# EAGLE design APMiniMax_V2 (EAGLE 7.7.0)
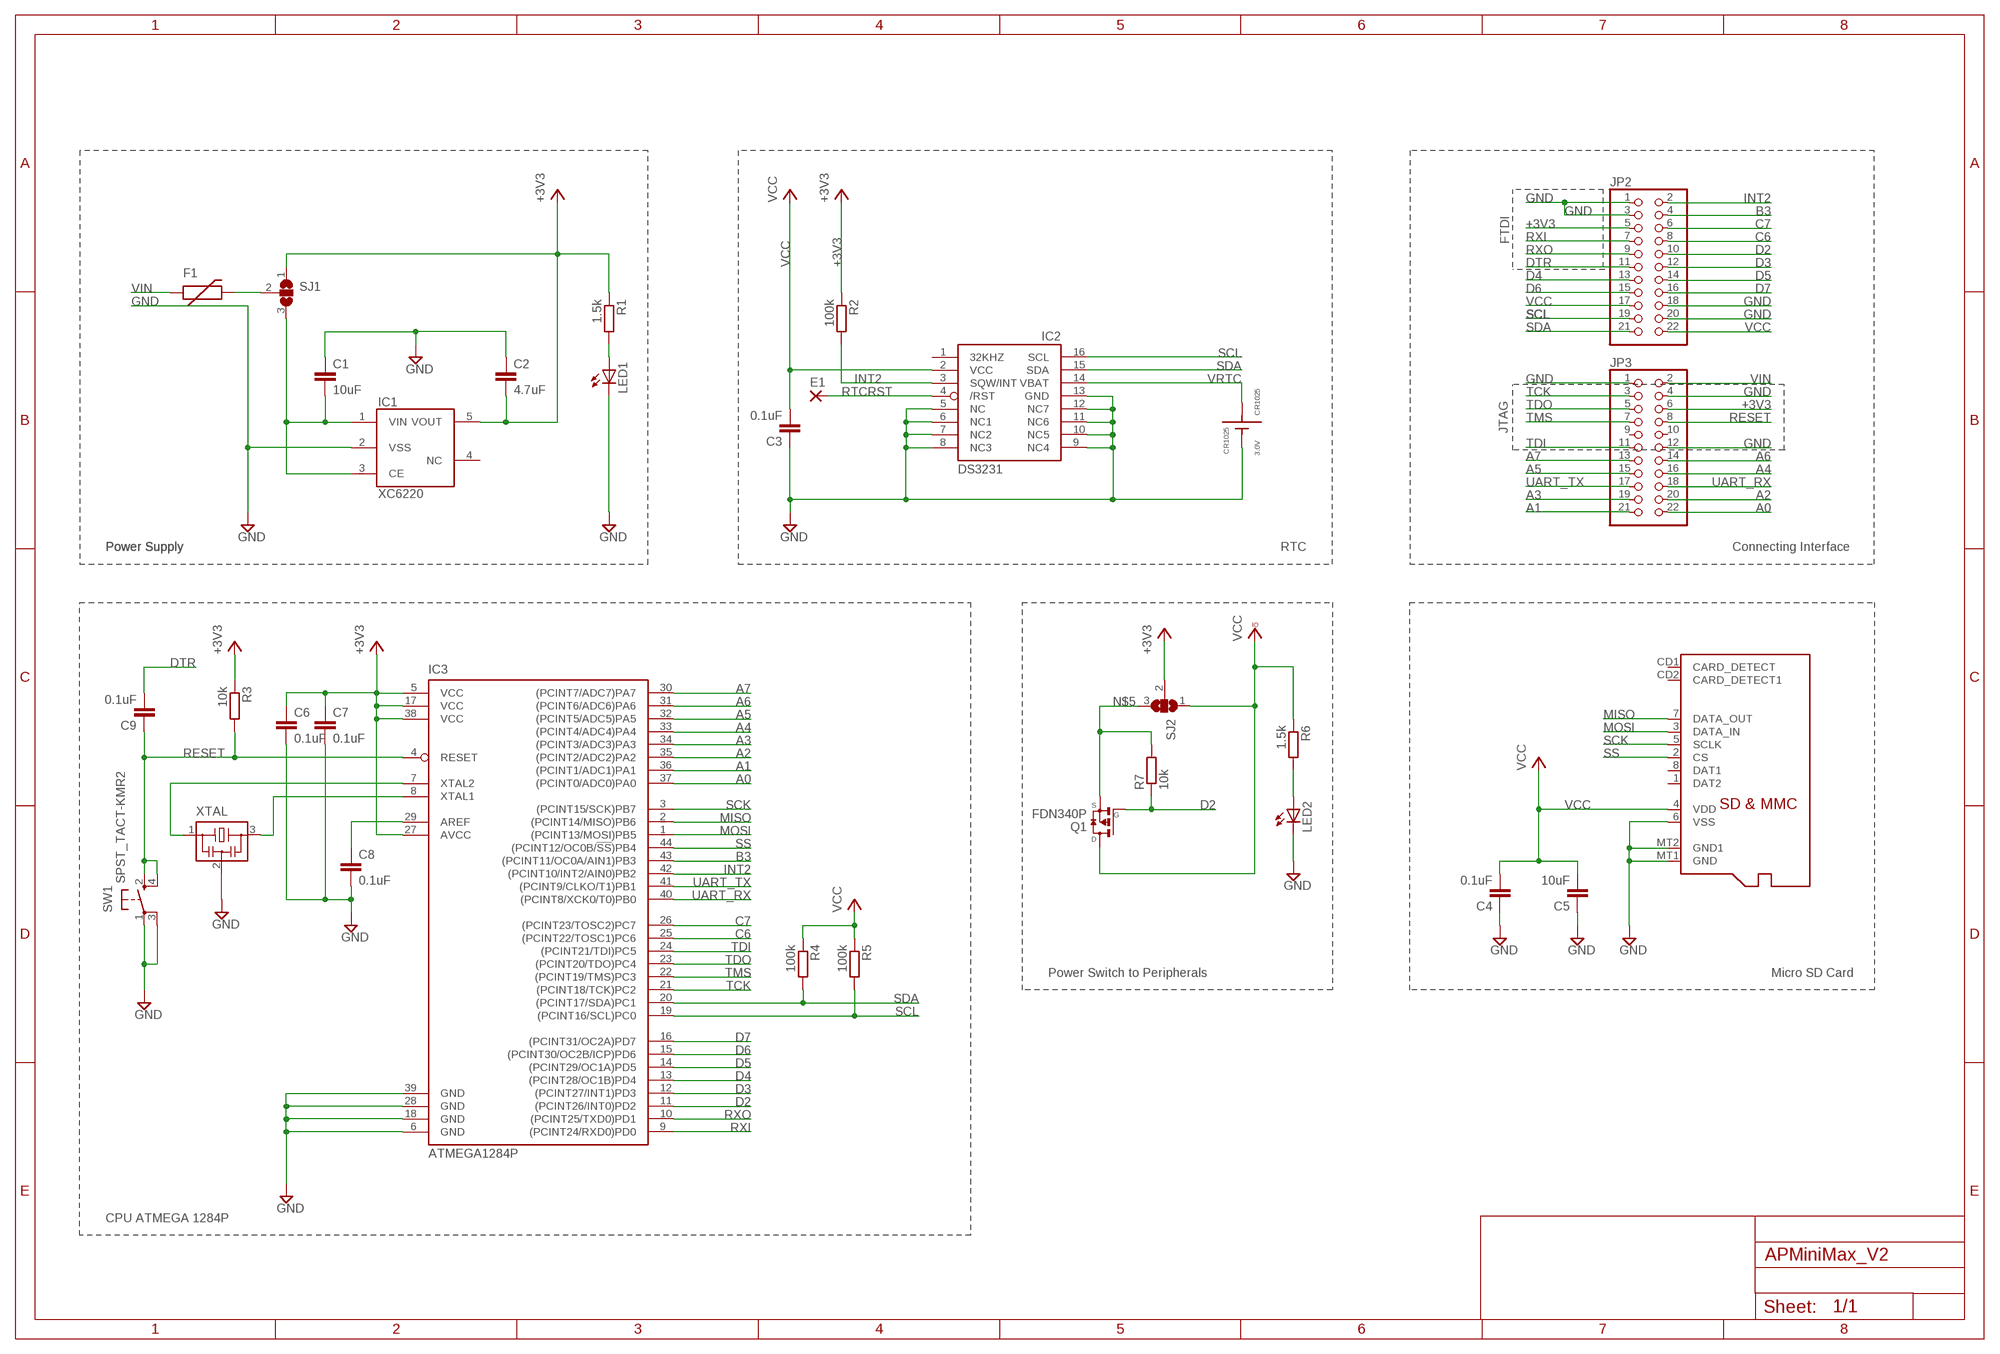
[diagram p0: schematic, sheet 1]

## Parts
C1  10uF  CC1206  [C1206]
C2  4.7uF  CC1206  [C1206]
C3  0.1uF  C  [C0805]
C4  0.1uF  C  [C0805]
C5  10uF  CC1206  [C1206]
C6  0.1uF  C  [C0805]
C7  0.1uF  C  [C0805]
C8  0.1uF  C  [C0805]
C9  0.1uF  C  [C0805]
CR1025  3.0V  CR1025  [CR1025SMD]
E1  0,75/0,5  [0,75/0,5]
F1  FUSE0805  [R0805]
IC1  XC6220SOT-25  [SOT25]
IC2  DS3231/SO  [SO16W]
IC3  ATMEGA1284P  ATMEGA644A  [TQFP44]
JP2  PINHD-2X11  [2X11]
JP3  PINHD-2X11  [2X11]
LED1  LEDCHIP-LED0805  [CHIP-LED0805]
LED2  LEDCHIP-LED0805  [CHIP-LED0805]
MMC  MICROSD  [MICROSD]
Q1  FDN340P  [SSOT-3]
R1  1.5k  R  [R0805]
R2  100k  R  [R0805]
R3  10k  R  [R0805]
R4  100k  R  [R0805]
R5  100k  R  [R0805]
R6  1.5k  R  [R0805]
R7  10k  R-EU_R0805  [R0805]
SJ1  SJ2W  [SJ_2]
SJ2  SJ2W  [SJ_2]
SW1  SPST_TACT-KMR2  [KMR2]
XTAL  CSTCE8M00G52-R0  [CSTCE]

## Nets
+3V3: C2.2 C6.1 C7.1 IC1.5(VOUT) IC3.5(VCC) IC3.17(VCC) IC3.27(AVCC) IC3.38(VCC) JP2.5 JP3.6 R1.1 R2.1 R3.1 SJ1.1 SJ2.2
A0: IC3.37((PCINT0/ADC0)PA0) JP3.22
A1: IC3.36((PCINT1/ADC1)PA1) JP3.21
A2: IC3.35((PCINT2/ADC2)PA2) JP3.20
A3: IC3.34((PCINT3/ADC3)PA3) JP3.19
A4: IC3.33((PCINT4/ADC4)PA4) JP3.16
A5: IC3.32((PCINT5/ADC5)PA5) JP3.15
A6: IC3.31((PCINT6/ADC6)PA6) JP3.14
A7: IC3.30((PCINT7/ADC7)PA7) JP3.13
AREF: C8.1 IC3.29(AREF)
B3: IC3.43((PCINT11/OC0A/AIN1)PB3) JP2.4
C6: IC3.25((PCINT22/TOSC1)PC6) JP2.8
C7: IC3.26((PCINT23/TOSC2)PC7) JP2.6
D2: IC3.11((PCINT26/INT0)PD2) JP2.10 Q1.1(G) R7.1
D3: IC3.12((PCINT27/INT1)PD3) JP2.12
D4: IC3.13((PCINT28/OC1B)PD4) JP2.13
D5: IC3.14((PCINT29/OC1A)PD5) JP2.14
D6: IC3.15((PCINT30/OC2B/ICP)PD6) JP2.15
D7: IC3.16((PCINT31/OC2A)PD7) JP2.16
DTR: C9.2 JP2.11
GND: C1.1 C2.1 C3.1 C4.1 C5.1 C6.2 C7.2 C8.2 CR1025.GND IC1.2(VSS) IC2.5(NC) IC2.6(NC1) IC2.7(NC2) IC2.8(NC3) IC2.9(NC4) IC2.10(NC5) IC2.11(NC6) IC2.12(NC7) IC2.13(GND) IC3.6(GND) IC3.18(GND) IC3.28(GND) IC3.39(GND) JP2.1 JP2.3 JP2.18 JP2.20 JP3.1 JP3.4 JP3.12 LED1.C LED2.C MMC.6(VSS) MMC.MT1(GND) MMC.MT2(GND1) SW1.1(P) SW1.3(P1) XTAL.2
INT2: IC2.3(SQW/INT) IC3.42((PCINT10/INT2/AIN0)PB2) JP2.2 R2.2
MISO: IC3.2((PCINT14/MISO)PB6) MMC.7(DATA_OUT)
MOSI: IC3.1((PCINT13/MOSI)PB5) MMC.3(DATA_IN)
N$1: LED1.A R1.2
N$2: F1.2 SJ1.2
N$3: C1.2 IC1.1(VIN) IC1.3(CE) SJ1.3
N$5: Q1.2(S) R7.2 SJ2.3
N$6: IC3.7(XTAL2) XTAL.1
N$7: IC3.8(XTAL1) XTAL.3
N$8: LED2.A R6.2
RESET: C9.1 IC3.4(RESET) JP3.8 R3.2 SW1.2(S) SW1.4(S1)
RTCRST: E1.1(P) IC2.4(/RST)
RXI: IC3.9((PCINT24/RXD0)PD0) JP2.7
RXO: IC3.10((PCINT25/TXD0)PD1) JP2.9
SCK: IC3.3((PCINT15/SCK)PB7) MMC.5(SCLK)
SCL: IC2.16(SCL) IC3.19((PCINT16/SCL)PC0) JP2.19 R5.2
SDA: IC2.15(SDA) IC3.20((PCINT17/SDA)PC1) JP2.21 R4.2
SS: IC3.44((PCINT12/OC0B/!SS!)PB4) MMC.2(CS)
TCK: IC3.21((PCINT18/TCK)PC2) JP3.3
TDI: IC3.24((PCINT21/TDI)PC5) JP3.11
TDO: IC3.23((PCINT20/TDO)PC4) JP3.5
TMS: IC3.22((PCINT19/TMS)PC3) JP3.7
UART_RX: IC3.40((PCINT8/XCK0/T0)PB0) JP3.18
UART_TX: IC3.41((PCINT9/CLKO/T1)PB1) JP3.17
VCC: C3.2 C4.2 C5.2 IC2.2(VCC) JP2.17 JP2.22 MMC.4(VDD) Q1.3(D) R4.1 R5.1 R6.1 SJ2.1
VIN: F1.1 JP3.2
VRTC: CR1025.V+@1(V+) CR1025.V+@2(V+) IC2.14(VBAT)
Unconnected: IC1.4(NC) IC2.1(32KHZ) JP3.9 JP3.10 MMC.1(DAT2) MMC.8(DAT1) MMC.CD1(CARD_DETECT) MMC.CD2(CARD_DETECT1)

## Notes on the sheet
- FTDI
- JTAG
- Power Supply | Power Supply | RTC | Connecting Interface
- Power Switch to Peripherals | Micro SD Card
- CPU ATMEGA 1284P

## Library data of the parts
C1-C9 = eagle-ltspice:C: CAPACITOR, European symbol; SPICEMODEL: NONE; SPICEPREFIX: C
CR1025 = eawag:CR1025
E1 = wirepad:0,75/0,5: THROUGH-HOLE PAD
F1 = Unilogger:FUSE0805
IC1 = eawag:XC6220: XC6220 Series 1A LDO Voltage Regulator with "Green Operation" Digikey Part Nr: 893-1133-1-ND
IC2 = adafruit:DS3231
IC3 = atmel:ATMEGA644: 8-bit Microcontroller with 64K Bytes In-System Programmable Flash Source: http://www.atmel.com/dyn/resources/prod_documents/doc2593.pdf; MPN: ATMEGA644PV-10AU; OC_FARNELL: 1455123; OC_NEWARK: 58M3748
JP2 JP3 = pinhead:PINHD-2X11: PIN HEADER
LED1 LED2 = eawag:LED: LED OSRAM: - CHIPLED LG R971, LG N971, LY N971, LG Q971, LY Q971, LO R971, LY R971 LH N974, LH R974 LS Q976, LO Q976, LY Q976 LO Q996 - Hyper CHIPLED LW Q18S LB Q993, LB Q99A, LB R99A - SideLED LS A670, LO A670, LY A670, LG A670, LP A670 LB A673, LV A673, LT A673, LW A673 LH A674 LY A675 LS A676, LA A676, LO A676, LY A676, LW A676 LS A679, LY A679, LG A679 - Hyper Micro SIDELED® LS Y876, LA Y876, LO Y876, LY Y876 LT Y87S - SmartLED LW L88C, LW L88S LB L89C, LB L89S, LG L890 LS L89K, LO L89K, LY L89K LS L896, LA L896, LO L896, LY L896 - TOPLED LS T670, LO T670, LY T670, LG T670, LP T670 LSG T670, LSP T670, LSY T670, LOP T670, LYG T670 LG T671, LOG T671, LSG T671 LB T673, LV T673, LT T673, LW T673 LH T674 LS T676, LA T676, LO T676, LY T676, LB T676, LH T676, LSB T676, LW T676 LB T67C, LV T67C, LT T67C, LS T67K, LO T67K, LY T67K, LW E67C LS E67B, LA E67B, LO E67B, LY E67B, LB E67C, LV E67C, LT E67C LW T67C LS T679, LY T679, LG T679 LS T770, LO T770, LY T770, LG T770, LP T770 LB T773, LV T773, LT T773, LW T773 LH T774 LS E675, LA E675, LY E675, LS T675 LS T776, LA T776, LO T776, LY T776, LB T776 LHGB T686 LT T68C, LB T68C - Hyper Mini TOPLED® LB M676 - Mini TOPLED Santana® LG M470 LS M47K, LO M47K, LY M47K Source: http://www.osram.convergy.de/
MMC = eawag:MICROSD: Micro-SD / Transflash card holder with SPI pinout For the 3M # 2908-05WB-MG and/or 4UCON #19656 push-push type
Q1 = transistor-fet:FDN340P: P-Channel MOSFET Logic Level, PowerTrench MOSFET
R1-R6 = eagle-ltspice:R: RESISTOR, European symbol; SPICEMODEL: NONE; SPICEPREFIX: R
R7 = 1_RCL-eawag:R-EU_: RESISTOR, European symbol
SJ1 SJ2 = jumper:SJ2W: SMD solder JUMPER
SW1 = adafruit:SPST_TACT: SMT 6mm switch, EVQQ2 series http://www.ladyada.net/library/eagle
XTAL = eawag:CSTC?: Resonator CSTCR �- 2.0 x 4.5 mm <http://search.murata.co.jp/Ceramy/CatalogAction.do?sHinnm=?&nbsp&sNHinnm=CSTCR6M00G53-R0&sNhin_key=CSTCR6M00G53-R0&sLang=en&sParam=CSTCR> CSTCE �- 1.3 x 3.2 mm <http://search.murata.co.jp/Ceramy/CatalogAction.do?sHinnm=?&nbsp&sNHinnm=CSTCE8M00G52-R0&sNhin_key=CSTCE8M00G52-R0&sLang=en&sParam=CSTCE>; FREQUENCY: 8 MHz; OC_MOUSER: 81-CSTCE8M00G52-R0

## Board
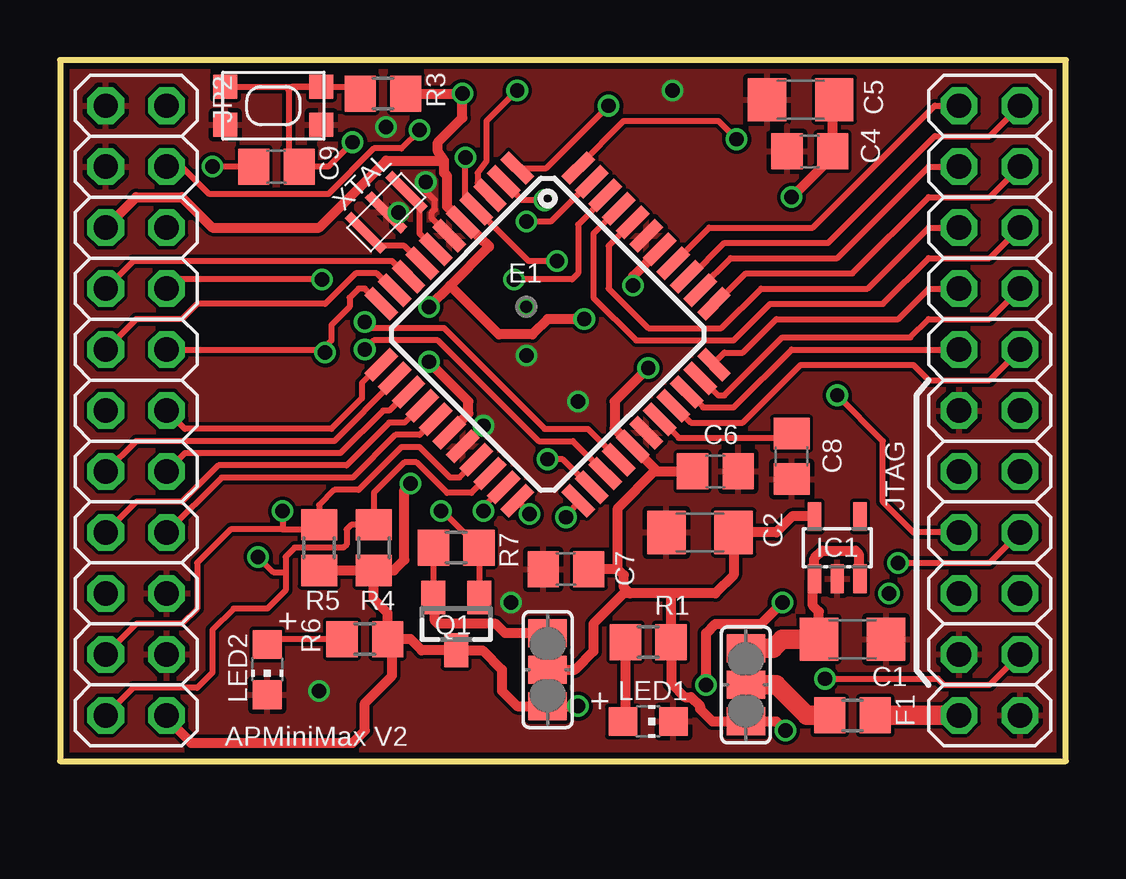
[diagram p1: board, top side]
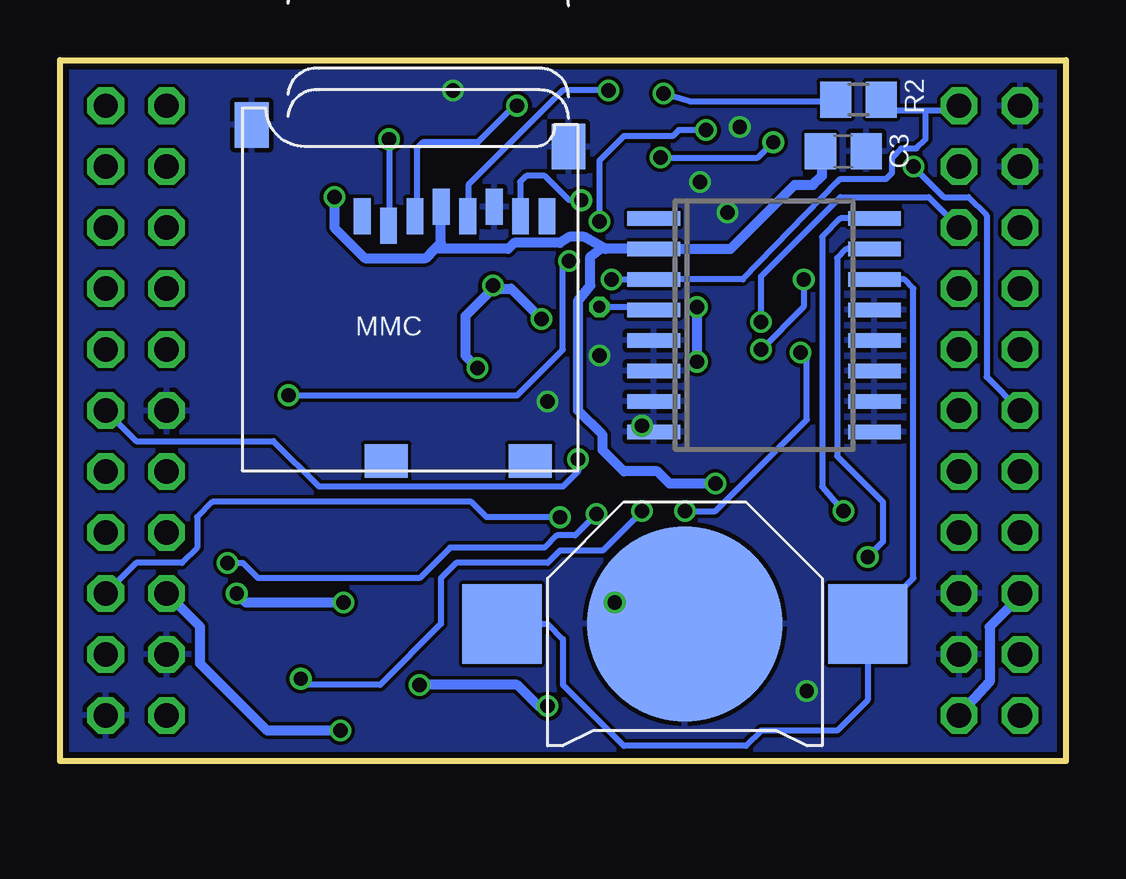
[diagram p2: board, bottom side, seen from below]

Size 41.91 x 29.21 mm. Coordinates in mm from the lower left corner, seen from the top.
Outline: 0,29.21 0,0 41.91,0 41.91,29.21 0,29.21
Copper layers (1*16): Top 0.018mm / dielectric 1.55mm / Bottom 0.018mm
Design rules "eC_2Layer_PClass6_BaseCopperO18_eCDefault": minimum track width 0.15mm, minimum drill 0.35mm, track to track 0.15mm, track to pad 0.15mm, pad to pad 0.15mm, via to via 0.15mm, smd to smd 0mil, copper to edge 0.25mm, drill to drill 0.35mm, minimum pad ring 0.175mm, minimum via ring 0.125mm, stop-mask expansion 0mil, vias tented up to drill 0.45mm, thermal gap 0.2mm

### Footprints (pad centres in the part's own frame; a part is rotated, then mirrored left to right if it is on the bottom)
C1206 = smd 1.6 x 1.8: 1 -1.4,0; 2 1.4,0
C0805 = smd 1.3 x 1.5: 1 -0.95,0; 2 0.95,0
CR1025SMD = smd 8.128 x 8.128: GND 0,0 | smd 3.302 x 3.302: V+@1 -7.62,0; V+@2 7.62,0
0,75/0,5 = drill 0.5 pad 0.75 octagon: 1 0,0
R0805 = smd 1.3 x 1.5: 1 -0.95,0; 2 0.95,0
SOT25 = smd 0.55 x 1.2: 1 -0.95,-1.3; 2 0,-1.3; 3 0.95,-1.3; 4 0.95,1.3; 5 -0.95,1.3
SO16W = smd 0.6 x 2.2: 1 -4.445,-4.6; 2 -3.175,-4.6; 3 -1.905,-4.6; 4 -0.635,-4.6; 5 0.635,-4.6; 6 1.905,-4.6; 7 3.175,-4.6; 8 4.445,-4.6; 9 4.445,4.6; 10 3.175,4.6; 11 1.905,4.6; 12 0.635,4.6; 13 -0.635,4.6; 14 -1.905,4.6; 15 -3.175,4.6; 16 -4.445,4.6
TQFP44 = smd 1.5 x 0.5: 1 -5.8,4; 2 -5.8,3.2; 3 -5.8,2.4; 4 -5.8,1.6; 5 -5.8,0.8; 6 -5.8,0; 7 -5.8,-0.8; 8 -5.8,-1.6; 9 -5.8,-2.4; 10 -5.8,-3.2; 11 -5.8,-4; 23 5.8,-4; 24 5.8,-3.2; 25 5.8,-2.4; 26 5.8,-1.6; 27 5.8,-0.8; 28 5.8,0; 29 5.8,0.8; 30 5.8,1.6; 31 5.8,2.4; 32 5.8,3.2; 33 5.8,4 | smd 0.5 x 1.5: 12 -4,-5.8; 13 -3.2,-5.8; 14 -2.4,-5.8; 15 -1.6,-5.8; 16 -0.8,-5.8; 17 0,-5.8; 18 0.8,-5.8; 19 1.6,-5.8; 20 2.4,-5.8; 21 3.2,-5.8; 22 4,-5.8; 34 4,5.8; 35 3.2,5.8; 36 2.4,5.8; 37 1.6,5.8; 38 0.8,5.8; 39 0,5.8; 40 -0.8,5.8; 41 -1.6,5.8; 42 -2.4,5.8; 43 -3.2,5.8; 44 -4,5.8
2X11 = drill 1.016 octagon: 1 -12.7,-1.27; 2 -12.7,1.27; 3 -10.16,-1.27; 4 -10.16,1.27; 5 -7.62,-1.27; 6 -7.62,1.27; 7 -5.08,-1.27; 8 -5.08,1.27; 9 -2.54,-1.27; 10 -2.54,1.27; 11 0,-1.27; 12 0,1.27; 13 2.54,-1.27; 14 2.54,1.27; 15 5.08,-1.27; 16 5.08,1.27; 17 7.62,-1.27; 18 7.62,1.27; 19 10.16,-1.27; 20 10.16,1.27; 21 12.7,-1.27; 22 12.7,1.27
CHIP-LED0805 = smd 1.2 x 1.2: A 0,-1.05; C 0,1.05
MICROSD = smd 0.7 x 1.5: 1 2.65,-4.29; 2 1.55,-3.89; 3 0.45,-4.29; 4 -0.65,-4.69; 5 -1.75,-4.29; 6 -2.85,-4.69; 7 -3.95,-4.29; 8 -5.05,-4.29 | smd 1.8 x 1.4: CD1 -4.35,5.91; CD2 1.65,5.91 | smd 1.4 x 1.9: MT1 -5.95,-7.19; MT2 7.25,-8.09
SSOT-3 = smd 1 x 1.4: 1 -0.95,-1.1; 2 0.95,-1.1; 3 0,1.1
SJ_2 = smd 1.168 x 1.6: 1 -1.524,0; 2 0,0; 3 1.524,0
KMR2 = smd 1 x 1: 1 2,0.8; 2 2,-0.8; 3 -2,0.8; 4 -2,-0.8
CSTCE = smd 0.4 x 2.1: 1 -1.2,0; 2 0,0; 3 1.2,0

### Placement (x,y rotation side)
C1  33.02,5.08 180 top
C2  26.67,9.53 0 top
C3  9.27,25.4 180 bottom
C4  31.24,25.4 0 top
C5  30.86,27.56 0 top
C6  27.3,12.06 0 top
C7  21.08,8 180 top
C8  30.48,12.7 270 top
C9  9.02,24.77 180 top
CR1025  15.88,5.71 180 bottom
E1  19.43,18.92 0 top
F1  33.02,1.91 180 top
IC1  32.38,8.89 0 top
IC2  12.57,18.16 270 bottom
IC3  20.32,17.78 315 top
JP2  3.17,14.61 270 top
JP3  38.73,14.61 90 top
LED1  24.51,1.65 270 top
LED2  8.64,3.81 180 top
MMC  26.67,18.41 180 bottom
Q1  16.51,5.71 180 top
R1  24.51,4.95 180 top
R2  8.64,27.56 0 bottom
R3  13.46,27.81 180 top
R4  13.08,8.89 90 top
R5  10.79,8.89 90 top
R6  12.7,5.08 180 top
R7  16.51,8.89 180 top
SJ1  28.57,3.17 90 top
SJ2  20.32,3.81 90 top
SW1  8.89,27.3 180 top
XTAL  13.59,22.86 225 top

### Tracks (layer width: path | path; a pad name or v marks a point on that pad's centre or on a via)
+3V3  (via drill 0.6)
  Top 0.254: IC3.5 16.8,22.45 | 16.13,23.1 16.13,23.11
  Top 0.406: 23.75,6.99 23.5,7.24 23.5,7.75 23.24,8 | 23.24,8 C7.1 | 24.83,12.13 IC3.27 23.11,13.86 23.11,14.99 v24.51,16.38 | 24.83,12.13 24.89,12.06 C6.1 | 23.24,8 23.24,10.54 24.83,12.13 | 16.13,23.1 IC3.5 | 16.8,22.45 17.87,21.46 17.87,21.43 16.26,19.81 | v23.88,19.81 23.88,20.2 IC3.38 | SJ2.2 21.46,3.81 22.23,4.57 22.23,5.71 23.5,6.99 23.75,6.99 | R3.1 v16.76,27.81 16.76,26.8 15.75,25.78 15.75,25.4 16,25.02 | IC3.17 17.02,14.48 17.02,14.99 v15.37,16.64 | 16.26,19.81 v15.37,18.92 | v21.84,18.41 20.32,18.41 19.68,17.78 18.29,17.78 16.26,19.81 | v30.23,1.27 29.84,1.65 SJ1.1 27.18,1.65 26.67,2.16 26.67,2.29 26.29,2.67 26.04,2.67 25.46,3.24 R1.1 25.46,6.92 25.4,6.99 | JP2.5 3.17,23.5 5.08,23.5 6.35,22.23 10.79,22.23 13.59,25.02 16,25.02 | 16.13,23.11 16.13,24.38 16,24.51 16,25.02 | IC1.5 30.51,10.19 29.84,9.53 C2.2 28.07,7.75 27.3,6.99 25.4,6.99 | 25.4,6.99 23.75,6.99
  Bottom 0.254: v16.76,27.81 15.69,27.49 9.65,27.49 R2.1 | v23.88,19.81 23.88,19.68
  Bottom 0.406: v24.51,16.38 25.02,16.89 25.02,18.54 23.88,19.68 23.11,19.68 v21.84,18.41 | v15.37,16.64 v15.37,18.92 | v30.23,1.27 33.27,1.27 36.07,4.06 36.07,5.59 JP3.6
A0
  Top 0.254: IC3.37 25.58,20.75 27.05,22.23 31.37,22.23 36.45,27.3 JP3.22
A1
  Top 0.254: IC3.36 26.28,20.18 27.69,21.59 32,21.59 36.45,26.04 38.73,26.04 JP3.21
A2
  Top 0.254: IC3.35 26.68,19.7 27.94,20.95 32.38,20.95 36.2,24.77 JP3.20
A3
  Top 0.254: IC3.34 27.31,19.05 28.57,20.32 33.02,20.32 36.2,23.5 38.73,23.5 JP3.19
A4
  Top 0.254: IC3.33 27.25,16.58 27.69,17.02 28.45,17.02 29.84,18.41 34.92,18.41 36.2,19.68 JP3.16
A5
  Top 0.254: IC3.32 26.73,15.94 27.43,15.24 27.69,15.24 30.1,17.65 35.43,17.65 36.2,18.41 38.73,18.41 JP3.15
A6
  Top 0.254: IC3.31 26.15,15.38 26.8,14.73 28.07,14.73 30.48,17.14 JP3.14
A7
  Top 0.254: IC3.30 25.58,14.81 26.29,14.1 28.45,14.1 30.86,16.51 35.56,16.51 36.2,15.88 38.73,15.88 JP3.13
AREF
  Top 0.254: IC3.29 25.78,13.46 30.29,13.46 C8.1
B3  (via drill 0.6)
  Top 0.254: IC3.43 22.11,24.14 20.45,22.48 v19.43,22.48 | JP2.4 5.08,24.77 6.22,23.62 11.18,23.62 13.08,25.53 14.22,25.53 v14.99,26.29
  Bottom 0.254: v14.99,26.29 16.13,26.29 16.38,26.04 18.41,26.04 19.43,25.02 v19.43,22.48
C6  (via drill 0.6)
  Top 0.254: 22.69,11.98 IC3.25 21.37,13.34 19.94,13.34 15.75,17.53 13.08,17.53 v12.7,17.14 | v10.92,20.07 4.83,20.07 JP2.8
  Bottom 0.254: v10.92,20.07 10.92,18.92 v12.7,17.14
C7  (via drill 0.6)
  Top 0.254: 23.27,12.55 IC3.26 21.99,13.84 20.19,13.84 16,18.03 12.95,18.03 v12.7,18.29
  Bottom 0.254: v12.7,18.29 12.7,20.19 9.4,23.5 5.71,23.5 JP2.6
D2  (via drill 0.6)
  Top 0.254: Q1.1 R7.1 16.06,10.29 16,10.29 v15.88,10.41 | IC3.11 13.33,19.05 12.7,19.68 12.45,19.68 12.06,19.3 12.06,18.92 11.3,18.16 11.3,17.53 11.05,17.27 v11.05,17.02 10.92,17.14 JP2.10
  Bottom 0.254: v15.88,10.41 14.61,10.41 10.79,14.22 10.79,16.76 v11.05,17.02
D3
  Top 0.254: IC3.12 13.33,16.51 12.57,15.75 12.57,15.11 11.3,13.84 5.21,13.84 JP2.12
D4
  Top 0.254: IC3.13 13.96,15.86 11.43,13.34 3.17,13.34 JP2.13
D5
  Top 0.254: IC3.14 14.49,15.38 13.72,14.61 13.46,14.61 11.68,12.83 5.21,12.83 JP2.14
D6
  Top 0.254: IC3.15 15.06,14.81 14.35,14.1 13.72,14.1 11.94,12.32 6.6,12.32 5.08,10.79 3.17,10.79 JP2.15
D7
  Top 0.254: IC3.16 14.99,13.59 13.97,13.59 12.19,11.81 6.73,11.81 JP2.16
DTR  (via drill 0.6)
  Top 0.254: C9.2 v6.35,24.77
  Bottom 0.254: v6.35,24.77 5.08,23.5 4.06,23.5 3.3,22.73 3.3,16 JP2.11
GND  (via drill 0.6)
  Top 0.254: IC3.6 | IC3.6 15.49,22.61 15.49,22.86 15.62,22.99 15.62,23.37 15.24,23.75 v15.24,24.13 | XTAL.2 v14.1,22.86 | v17.65,13.97 17.51,13.84 IC3.18
  Bottom 0.254: IC2.8 17.53,13.72 v17.65,13.97
  other vias: 19.43,16.89 21.59,14.99 13.59,26.42 25.53,27.94 10.79,2.92 18.8,6.6
  pour Top: -1.27,30.48 -1.27,-1.27 43.18,-1.27 43.18,30.48
  pour Bottom: -0.64,29.84 -0.64,-0.64 42.55,-0.64 42.55,29.84
INT2  (via drill 0.6)
  Top 0.254: IC3.42 22.72,23.49 21.59,22.35 21.59,20.32 21.34,20.07 v18.92,20.07
  Bottom 0.254: v18.92,20.07 IC2.3 13.46,20.07 9.53,24.13 9.4,24.26 7.49,24.26 7.24,24.51 7.24,25.15 6.86,25.53 6.22,25.53 5.84,25.91 5.84,27.11 | 4.57,27.43 JP2.2 4.64,27.11 5.84,27.11 | R2.2 7.24,27.11 5.84,27.11
MISO  (via drill 0.6)
  Top 0.254: 18.53,24.14 IC3.2 19.26,23.37 v20.19,23.37
  Bottom 0.254: MMC.7 22.73,22.72 22.73,24.13 22.48,24.38 21.72,24.38 20.7,23.37 v20.19,23.37
MOSI  (via drill 0.6)
  Top 0.254: IC3.1 20.27,24.71 v22.86,27.3
  Bottom 0.254: v22.86,27.3 22.99,27.3 24.51,25.78 26.8,25.78 27.05,25.53 27.05,22.77 MMC.3
N$1
  Top 0.406: R1.2 23.56,1.75 LED1.A
N$2
  Top 0.813: F1.2 31.11,1.91 29.84,3.17 SJ1.2
N$3
  Top 0.406: C1.2 31.62,6.23 31.37,6.48 31.37,7.52 IC1.1 31.43,8.45 31.75,8.76 33.15,8.76 33.27,8.64 33.27,7.65 IC1.3
  Top 0.813: SJ1.3 29.72,4.7 30.1,5.08 C1.2
N$5
  Top 0.254: R7.2 Q1.2
  Top 0.406: SJ2.3 18.54,5.33 18.16,5.71 15.75,5.71 15.62,5.84 15.62,6.75 Q1.2
N$6
  Top 0.254: IC3.7 14.99,21.97 14.99,23.24 14.9,23.24 XTAL.1
N$7
  Top 0.254: IC3.8 15.06,20.75 14.35,21.46 13.34,21.46 13.21,21.59 13.16,21.59 XTAL.3
N$8
  Top 0.254: R6.2 8.86,5.08 LED2.A
RESET  (via drill 0.6)
  Top 0.254: SW1.2 SW1.4 | SW1.4 12.22,28.11 R3.2 | SW1.4 9.69,28.11 9.53,27.94 9.53,25.21 C9.1 11.18,24.77 v12.19,25.78 | JP3.8 35.56,9.53 34.29,10.79 34.29,13.34 v32.38,15.24 | v20.7,20.83 19.54,20.83 IC3.4 17.35,23.04 16.89,23.5 v16.89,25.15
  Bottom 0.254: v32.38,15.24 22.86,15.24 20.95,17.14 20.95,20.57 v20.7,20.83 | v16.89,25.15 12.83,25.15 v12.19,25.78
RTCRST
  Bottom 0.254: E1.1 17.3,18.92 IC2.4
RXI
  Top 0.254: IC3.9 14.49,20.18 13.84,20.83 3.05,20.83 JP2.7
RXO
  Top 0.254: IC3.10 13.91,19.62 13.21,20.32 12.32,20.32 11.05,19.05 5.71,19.05 5.08,18.41 3.17,18.41 JP2.9
SCK  (via drill 0.6)
  Top 0.254: 17.92,23.61 IC3.3 17.4,24.09 17.4,24.51 17.78,25.02 17.78,26.67 v19.05,27.94
  Bottom 0.254: v19.05,27.94 20.95,27.94 24.89,24 24.89,22.73 MMC.5
SCL  (via drill 0.6)
  Top 0.254: IC3.19 17.35,12.52 16.64,11.81 16.26,11.81 14.99,13.08 14.22,13.08 12.45,11.3 11.43,11.3 10.79,10.67 R5.2 10.61,9.65 9.27,9.65 | v9.27,10.41 9.27,9.65 | 9.27,9.65 7.11,9.65 5.71,8.26 5.71,6.35 5.08,5.71 3.17,5.71 JP2.19
  Bottom 0.254: IC2.16 9.4,22.61 10.16,21.84 10.16,11.43 v9.27,10.41
SDA  (via drill 0.6)
  Top 0.254: IC3.20 17.92,11.82 17.79,11.82 17.14,11.18 16.13,11.18 14.86,12.45 14.35,12.45 13.08,11.18 R4.2 | 13.27,10.03 R4.2 | R4.2 12.13,9.84 11.94,9.65 11.94,9.02 11.81,8.89 9.78,8.89 9.4,8.51 9.4,7.87 | 9.4,7.87 9.4,7.11 8.64,6.35 7.24,6.35 6.35,5.46 6.35,3.68 5.71,3.05 3.05,3.05 JP2.21 | v8.26,8.51 8.89,7.87 9.4,7.87
  Bottom 0.254: IC2.15 9.14,21.34 9.53,20.95 9.53,12.7 7.62,10.79 7.62,9.14 v8.26,8.51
SS  (via drill 0.6)
  Top 0.254: IC3.44 21.59,24.77 23.5,26.67 27.43,26.67 v28.19,25.91
  Bottom 0.254: v28.19,25.91 28.19,22.33 MMC.2
TCK  (via drill 0.6)
  Top 0.254: IC3.21 17.65,10.59 v17.65,10.41 | v31.88,3.43 36.58,3.43 36.83,3.17 38.73,3.17 JP3.3
  Bottom 0.254: v17.65,10.41 19.3,8.76 21.08,8.76 21.59,8.26 25.4,8.26 26.04,7.62 26.04,5.71 28.57,3.17 31.62,3.17 v31.88,3.43
TDI  (via drill 0.6)
  Top 0.254: IC3.24 22.11,11.42 20.95,12.57 v20.32,12.57
  Bottom 0.254: v20.32,12.57 20.32,12.06 20.95,11.43 31.11,11.43 33.02,13.34 38.73,13.34 JP3.11
TDO  (via drill 0.6)
  Top 0.254: IC3.23 21.59,10.8 v21.08,10.16
  Bottom 0.254: v21.08,10.16 24.13,10.16 24.77,10.79 35.56,10.79 36.2,10.16 36.2,8.89 36.83,8.26 38.73,8.26 JP3.5
TMS  (via drill 0.6)
  Top 0.254: v19.56,10.29 19.68,10.21 IC3.22 | v34.92,8.26 38.73,8.26 JP3.7
  Bottom 0.254: v19.56,10.29 20.45,9.4 21.21,9.4 21.72,8.89 25.65,8.89 26.92,7.62 33.66,7.62 34.29,8.26 v34.92,8.26
UART_RX
  Top 0.254: IC3.40 23.84,22.45 22.86,21.46 22.86,19.68 24.51,18.03 27.56,18.03 29.21,19.68 33.66,19.68 36.2,22.23 JP3.18
UART_TX
  Top 0.254: IC3.41 23.27,23.01 22.23,21.97 22.23,19.3 24,17.53 28.07,17.53 29.59,19.05 34.29,19.05 36.2,20.95 38.73,20.95 JP3.17
VCC  (via drill 0.6)
  Top 0.254: C4.2 32.19,25.21 | 32.19,27.49 C5.2
  Top 0.406: 32.19,25.21 v30.48,23.5 | C4.2 32.19,27.49 | R6.1 14.61,5.08 15.07,4.62 Q1.3 17.61,4.62 18.41,3.81 18.41,2.92 19.05,2.29 SJ2.1 v21.59,2.29 | R6.1 13.65,6.16 13.08,6.73 R4.1 | R5.1 R4.1 | v26.92,3.17 26.92,5.33 27.3,5.71 29.21,5.71 v30.1,6.6 | JP2.22 4.45,1.78 5.46,0.76 12.19,0.76 12.7,1.27 12.7,2.41 13.84,3.56 13.84,4.89 R6.1 | R4.1 13.91,7.94 14.35,8.38 14.35,11.3 v14.61,11.56
  Bottom 0.406: v34.54,6.99 34.16,6.6 v30.1,6.6 | 19.3,21.41 19.18,21.34 IC2.2 13.97,21.34 11.3,24 10.54,24 10.16,24.38 10.16,25.34 C3.2 | 19.3,21.41 20.07,21.84 20.7,21.84 21.08,21.59 22.99,21.59 23.24,21.34 26.29,21.34 | v30.48,23.5 30.48,22.23 29.21,20.95 26.67,20.95 26.29,21.34 | v21.59,2.29 21.97,2.29 22.86,3.17 v26.92,3.17 | JP2.17 1.91,6.86 3.17,5.59 3.17,3.3 JP2.22 | v14.61,11.56 16.51,11.56 17.02,12.06 18.41,12.06 19.3,12.95 19.3,13.59 20.32,14.61 20.32,19.18 19.81,19.81 19.81,21.02 19.3,21.41 | 26.29,21.34 26.04,21.59 26.04,23.09 MMC.4
VIN
  Top 0.813: JP3.2 F1.1
VRTC
  Bottom 0.254: CR1025.V+@2 21.59,5.71 20.95,5.08 20.95,3.17 18.41,0.64 13.34,0.64 12.7,1.27 9.53,1.27 8.26,2.54 CR1025.V+@1 6.35,7.62 6.35,19.68 6.73,20.07 IC2.14

### Text on the board
tNames: JTAG | APMiniMax V2